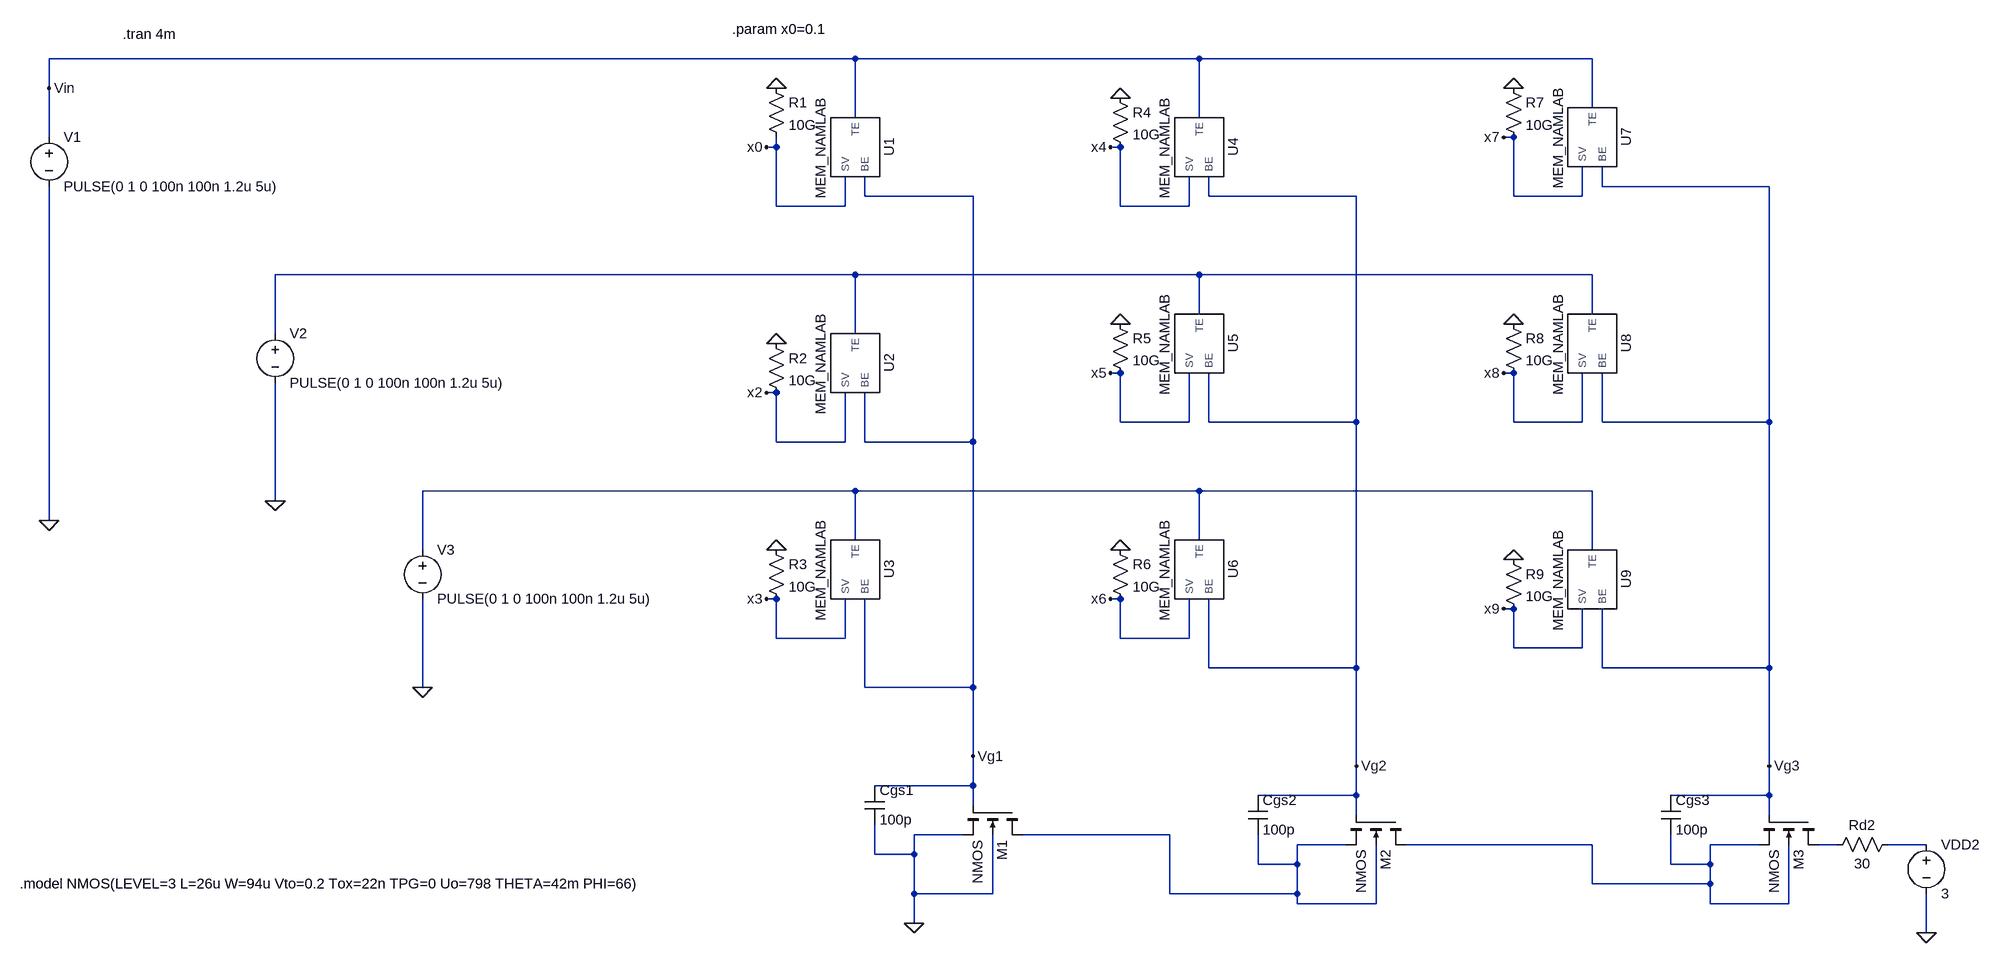
[diagram p0: schematic 3x3_neuromemrsitor.asc]
3x3_neuromemrsitor.asc, the LTspice schematic file:
Version 4
SHEET 1 2316 1284
WIRE 480 -160 -832 -160
WIRE 1040 -160 480 -160
WIRE 1680 -160 1040 -160
WIRE -832 -112 -832 -160
WIRE 1680 -80 1680 -160
WIRE 480 -64 480 -160
WIRE 1040 -64 1040 -160
WIRE -832 -32 -832 -112
WIRE 1552 -32 1536 -32
WIRE 352 -16 352 -32
WIRE 352 -16 336 -16
WIRE 912 -16 896 -16
WIRE 1696 48 1696 16
WIRE 1968 48 1696 48
WIRE 496 64 496 32
WIRE 672 64 496 64
WIRE 1056 64 1056 32
WIRE 1296 64 1056 64
WIRE 1552 64 1552 -32
WIRE 1664 64 1664 16
WIRE 1664 64 1552 64
WIRE 352 80 352 -16
WIRE 464 80 464 32
WIRE 464 80 352 80
WIRE 912 80 912 -16
WIRE 1024 80 1024 32
WIRE 1024 80 912 80
WIRE 480 192 -464 192
WIRE 1040 192 480 192
WIRE 1680 192 1040 192
WIRE 1040 256 1040 192
WIRE 1680 256 1680 192
WIRE -464 288 -464 192
WIRE 480 288 480 192
WIRE 912 352 896 352
WIRE 1552 352 1536 352
WIRE 352 384 336 384
WIRE 912 432 912 352
WIRE 1024 432 1024 352
WIRE 1024 432 912 432
WIRE 1056 432 1056 352
WIRE 1296 432 1296 64
WIRE 1296 432 1056 432
WIRE 1552 432 1552 352
WIRE 1664 432 1664 352
WIRE 1664 432 1552 432
WIRE 1696 432 1696 352
WIRE 1968 432 1968 48
WIRE 1968 432 1696 432
WIRE 352 464 352 384
WIRE 464 464 464 384
WIRE 464 464 352 464
WIRE 496 464 496 384
WIRE 672 464 672 64
WIRE 672 464 496 464
WIRE 480 544 -224 544
WIRE 1040 544 480 544
WIRE 1680 544 1040 544
WIRE -464 560 -464 368
WIRE -832 592 -832 48
WIRE 480 624 480 544
WIRE 1040 624 1040 544
WIRE -224 640 -224 544
WIRE 1680 640 1680 544
WIRE 352 720 336 720
WIRE 912 720 896 720
WIRE 1552 736 1536 736
WIRE 352 784 352 720
WIRE 464 784 464 720
WIRE 464 784 352 784
WIRE 912 784 912 720
WIRE 1024 784 1024 720
WIRE 1024 784 912 784
WIRE 1552 800 1552 736
WIRE 1664 800 1664 736
WIRE 1664 800 1552 800
WIRE 1056 832 1056 720
WIRE 1296 832 1296 432
WIRE 1296 832 1056 832
WIRE 1696 832 1696 736
WIRE 1968 832 1968 432
WIRE 1968 832 1696 832
WIRE -224 864 -224 720
WIRE 496 864 496 720
WIRE 672 864 672 464
WIRE 672 864 496 864
WIRE 672 976 672 864
WIRE 1296 992 1296 832
WIRE 1968 992 1968 832
WIRE 672 1024 672 976
WIRE 672 1024 512 1024
WIRE 1296 1040 1296 992
WIRE 1296 1040 1136 1040
WIRE 1968 1040 1968 992
WIRE 1968 1040 1808 1040
WIRE 672 1056 672 1024
WIRE 1296 1072 1296 1040
WIRE 1968 1072 1968 1040
WIRE 656 1104 576 1104
WIRE 992 1104 752 1104
WIRE 1280 1120 1200 1120
WIRE 1680 1120 1376 1120
WIRE 1952 1120 1872 1120
WIRE 2080 1120 2048 1120
WIRE 2224 1120 2160 1120
WIRE 512 1136 512 1088
WIRE 576 1136 576 1104
WIRE 576 1136 512 1136
WIRE 1136 1152 1136 1104
WIRE 1200 1152 1200 1120
WIRE 1200 1152 1136 1152
WIRE 1808 1152 1808 1104
WIRE 1872 1152 1872 1120
WIRE 1872 1152 1808 1152
WIRE 1680 1184 1680 1120
WIRE 1872 1184 1872 1152
WIRE 1872 1184 1680 1184
WIRE 576 1200 576 1136
WIRE 704 1200 704 1104
WIRE 704 1200 576 1200
WIRE 992 1200 992 1104
WIRE 1200 1200 1200 1152
WIRE 1200 1200 992 1200
WIRE 1200 1216 1200 1200
WIRE 1328 1216 1328 1120
WIRE 1328 1216 1200 1216
WIRE 1872 1216 1872 1184
WIRE 2000 1216 2000 1120
WIRE 2000 1216 1872 1216
WIRE 576 1248 576 1200
WIRE 2224 1264 2224 1200
FLAG -832 592 0
FLAG 336 -16 x0
FLAG 576 1248 0
FLAG -832 -112 Vin
FLAG 672 976 Vg1
FLAG -224 864 0
FLAG -464 560 0
FLAG 1296 992 Vg2
FLAG 2224 1264 0
FLAG 1968 992 Vg3
FLAG 896 -16 x4
FLAG 352 -112 0
FLAG 912 -96 0
FLAG 1536 -32 x7
FLAG 1552 -112 0
FLAG 336 384 x2
FLAG 352 304 0
FLAG 896 352 x5
FLAG 912 272 0
FLAG 1536 352 x8
FLAG 1552 272 0
FLAG 336 720 x3
FLAG 352 640 0
FLAG 896 720 x6
FLAG 912 640 0
FLAG 1536 736 x9
FLAG 1552 656 0
SYMBOL voltage -832 -48 R0
WINDOW 123 0 0 Left 0
WINDOW 39 0 0 Left 0
SYMATTR InstName V1
SYMATTR Value PULSE(0 1 0 100n 100n 1.2u 5u)
SYMBOL nmos4 752 1056 R90
SYMATTR InstName M1
SYMBOL cap 496 1024 R0
SYMATTR InstName Cgs1
SYMATTR Value 100p
SYMBOL MEM_NAMLAB\ mit\ cap 480 -16 R90
SYMATTR InstName U1
SYMBOL MEM_NAMLAB\ mit\ cap 480 336 R90
SYMATTR InstName U2
SYMBOL voltage -464 272 R0
WINDOW 123 0 0 Left 0
WINDOW 39 0 0 Left 0
SYMATTR InstName V2
SYMATTR Value PULSE(0 1 0 100n 100n 1.2u 5u)
SYMBOL voltage -224 624 R0
WINDOW 123 0 0 Left 0
WINDOW 39 0 0 Left 0
SYMATTR InstName V3
SYMATTR Value PULSE(0 1 0 100n 100n 1.2u 5u)
SYMBOL MEM_NAMLAB\ mit\ cap 480 672 R90
SYMATTR InstName U3
SYMBOL nmos4 1376 1072 R90
SYMATTR InstName M2
SYMBOL cap 1120 1040 R0
SYMATTR InstName Cgs2
SYMATTR Value 100p
SYMBOL voltage 2224 1104 R0
SYMATTR InstName VDD2
SYMATTR Value 3
SYMBOL res 2176 1104 R90
WINDOW 0 0 56 VBottom 2
WINDOW 3 32 56 VTop 2
SYMATTR InstName Rd2
SYMATTR Value 30
SYMBOL nmos4 2048 1072 R90
SYMATTR InstName M3
SYMBOL cap 1792 1040 R0
SYMATTR InstName Cgs3
SYMATTR Value 100p
SYMBOL MEM_NAMLAB\ mit\ cap 1040 -16 R90
SYMATTR InstName U4
SYMBOL MEM_NAMLAB\ mit\ cap 1680 -32 R90
SYMATTR InstName U7
SYMBOL MEM_NAMLAB\ mit\ cap 1040 304 R90
SYMATTR InstName U5
SYMBOL MEM_NAMLAB\ mit\ cap 1680 304 R90
SYMATTR InstName U8
SYMBOL MEM_NAMLAB\ mit\ cap 1040 672 R90
SYMATTR InstName U6
SYMBOL MEM_NAMLAB\ mit\ cap 1680 688 R90
SYMATTR InstName U9
SYMBOL res 336 -128 R0
SYMATTR InstName R1
SYMATTR Value 10G
SYMBOL res 896 -112 R0
SYMATTR InstName R4
SYMATTR Value 10G
SYMBOL res 1536 -128 R0
SYMATTR InstName R7
SYMATTR Value 10G
SYMBOL res 336 288 R0
SYMATTR InstName R2
SYMATTR Value 10G
SYMBOL res 896 256 R0
SYMATTR InstName R5
SYMATTR Value 10G
SYMBOL res 1536 256 R0
SYMATTR InstName R8
SYMATTR Value 10G
SYMBOL res 336 624 R0
SYMATTR InstName R3
SYMATTR Value 10G
SYMBOL res 896 624 R0
SYMATTR InstName R6
SYMATTR Value 10G
SYMBOL res 1536 640 R0
SYMATTR InstName R9
SYMATTR Value 10G
TEXT -712 -200 Left 2 !.tran 4m
TEXT 280 -208 Left 2 !.param x0=0.1
TEXT -880 1184 Left 2 !.model NMOS(LEVEL=3 L=26u W=94u Vto=0.2 Tox=22n TPG=0 Uo=798 THETA=42m PHI=66)

The netlist it stands for:
* 3x3_neuromemrsitor.asc
V1 Vin 0 PULSE(0 1 0 100n 100n 1.2u 5u)
M1 N003 Vg1 0 0 NMOS
Cgs1 Vg1 0 100p
XU1 Vin Vg1 x0 MEM_NAMLAB  ; pins TE BE SV
XU2 N001 Vg1 x2 MEM_NAMLAB  ; pins TE BE SV
V2 N001 0 PULSE(0 1 0 100n 100n 1.2u 5u)
V3 N002 0 PULSE(0 1 0 100n 100n 1.2u 5u)
XU3 N002 Vg1 x3 MEM_NAMLAB  ; pins TE BE SV
M2 N004 Vg2 N003 N003 NMOS
Cgs2 Vg2 N003 100p
VDD2 N006 0 3
Rd2 N006 N005 30
M3 N005 Vg3 N004 N004 NMOS
Cgs3 Vg3 N004 100p
XU4 Vin Vg2 x4 MEM_NAMLAB  ; pins TE BE SV
XU7 Vin Vg3 x7 MEM_NAMLAB  ; pins TE BE SV
XU5 N001 Vg2 x5 MEM_NAMLAB  ; pins TE BE SV
XU8 N001 Vg3 x8 MEM_NAMLAB  ; pins TE BE SV
XU6 N002 Vg2 x6 MEM_NAMLAB  ; pins TE BE SV
XU9 N002 Vg3 x9 MEM_NAMLAB  ; pins TE BE SV
R1 0 x0 10G
R4 0 x4 10G
R7 0 x7 10G
R2 0 x2 10G
R5 0 x5 10G
R8 0 x8 10G
R3 0 x3 10G
R6 0 x6 10G
R9 0 x9 10G
.model NMOS NMOS
.model PMOS PMOS
.lib standard.mos
.tran 4m
.param x0=0.1
.model NMOS(LEVEL=3 L=26u W=94u Vto=0.2 Tox=22n TPG=0 Uo=798 THETA=42m PHI=66)
.lib C:\Users\dhanu\OneDrive\Documents\My files\GITHUB\Neuro-transistor-Simulation-with-Memristor-based-Memcapacitor-using-LTSPICE\src\task9\MEM_NAMLAB.cir
.backanno
.end